# EAGLE board DSPBoard (EAGLE 9.2.2), part 1 of 2
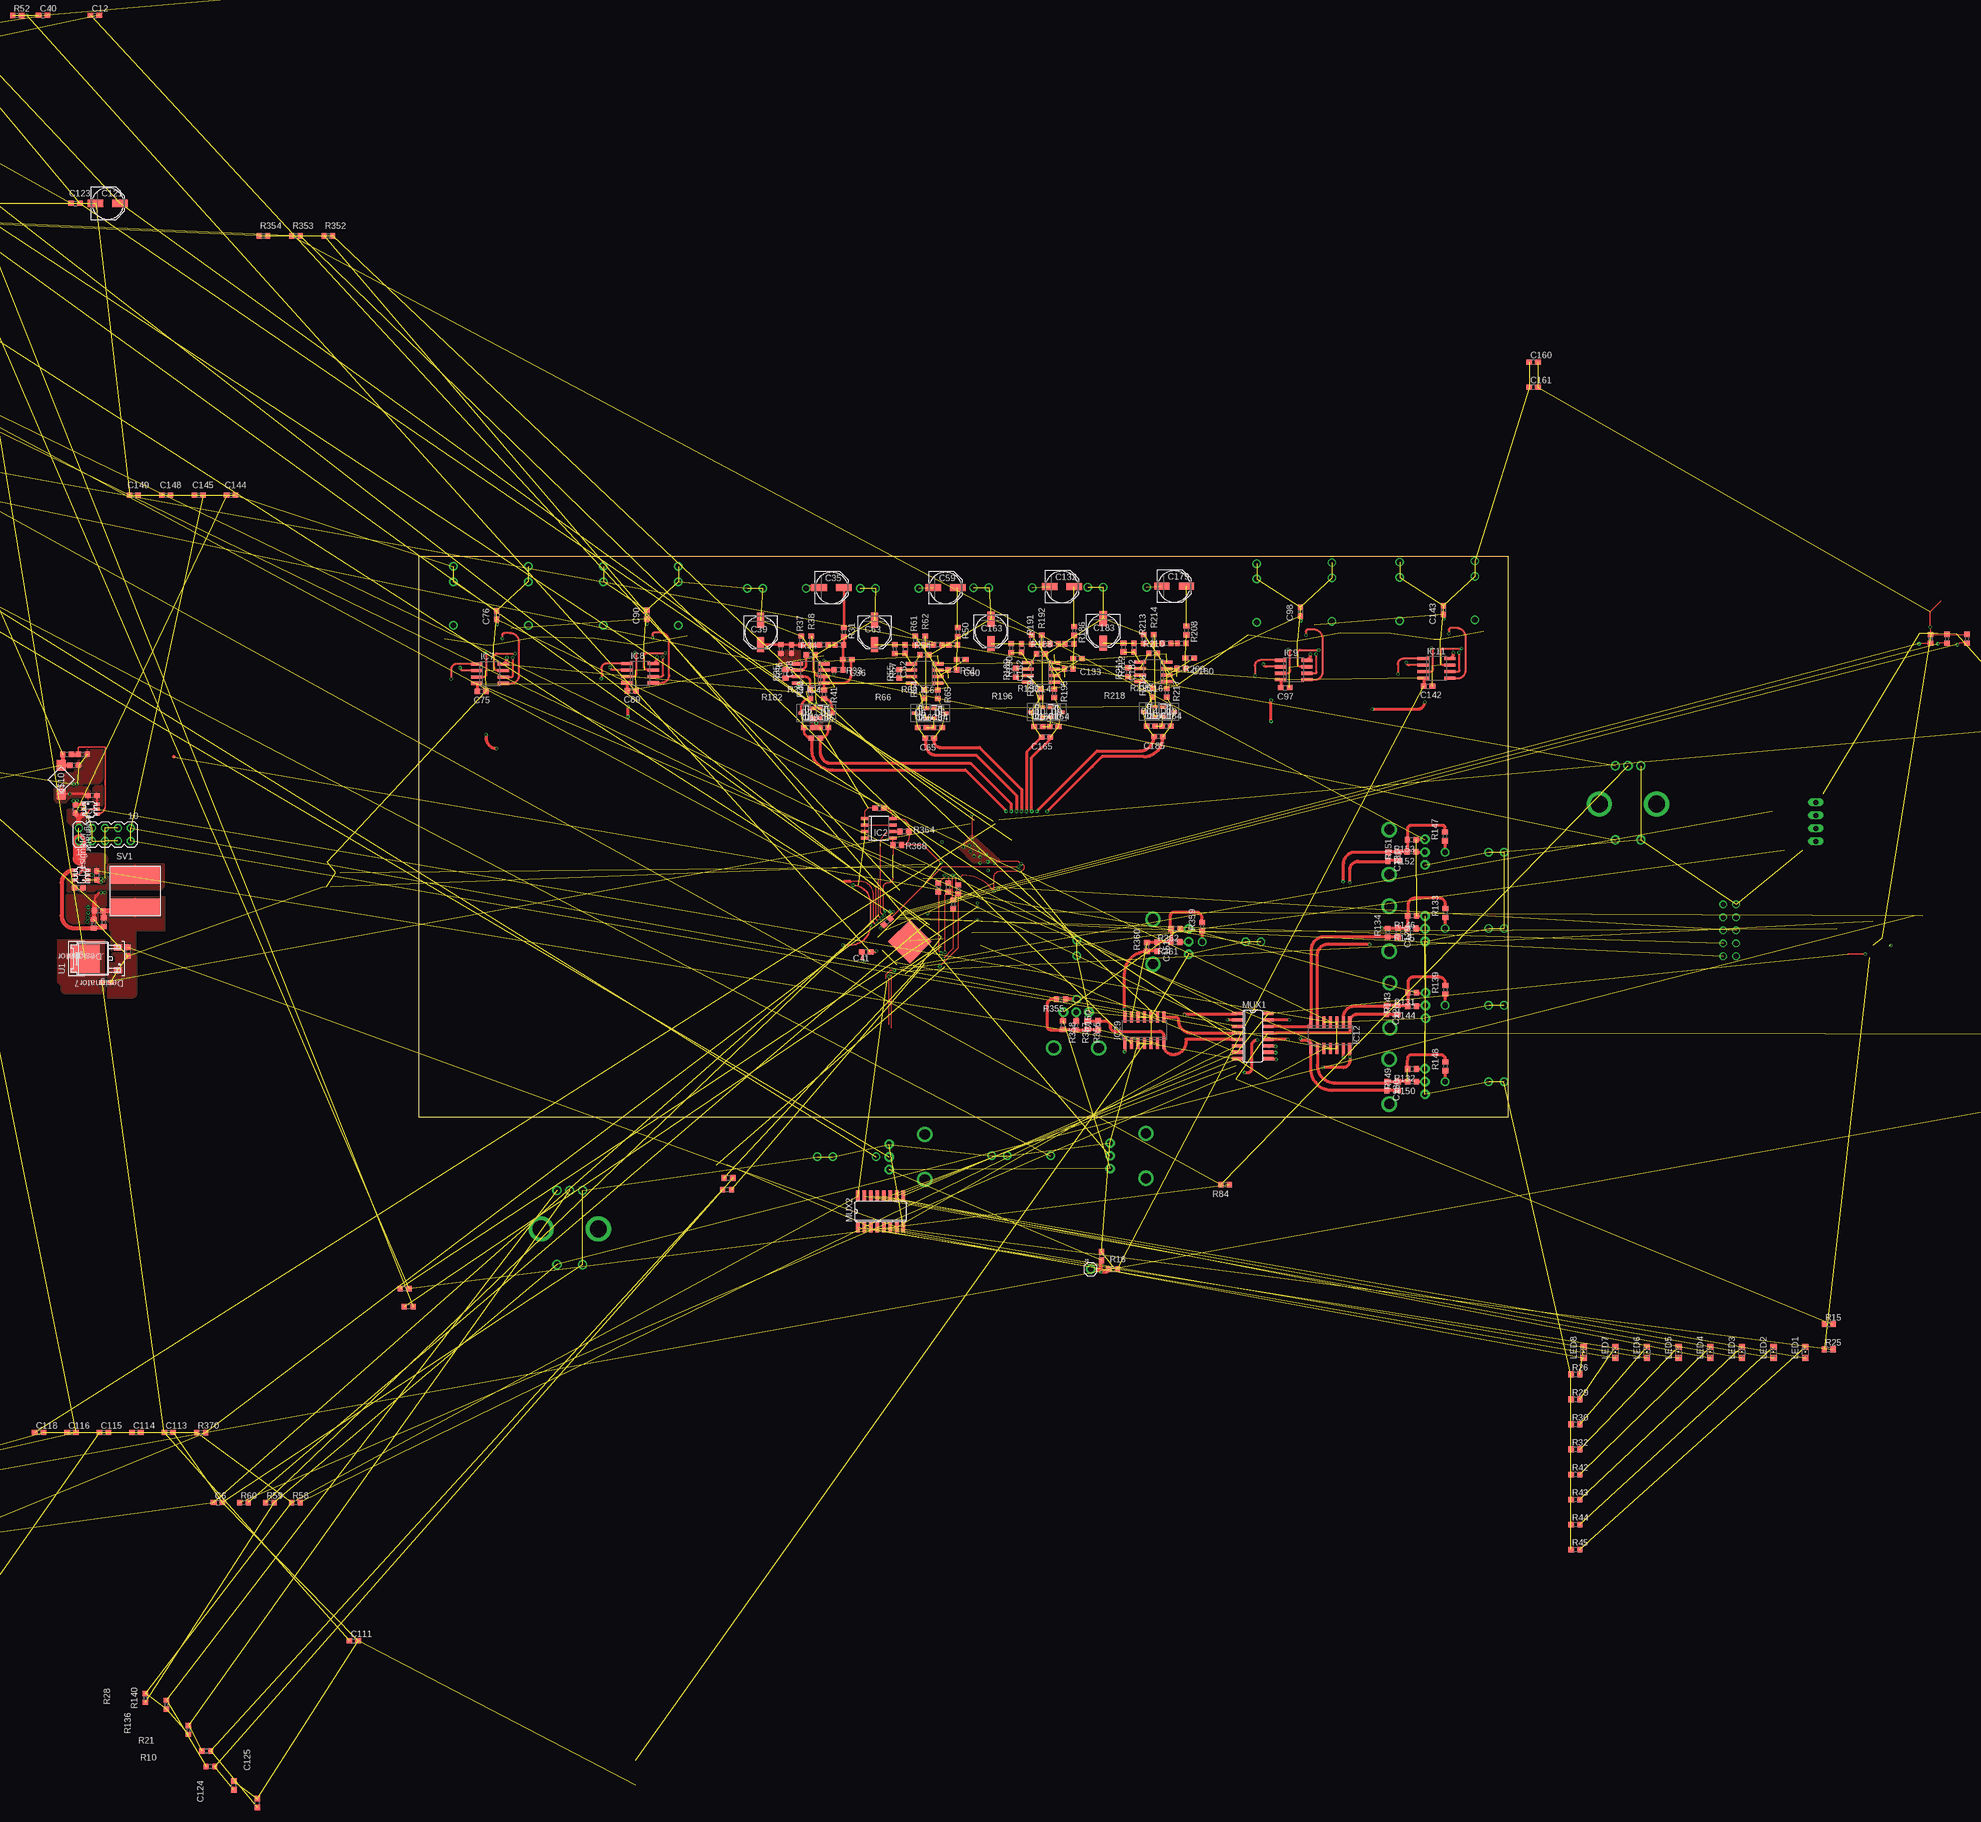
[diagram p9: board, top side]
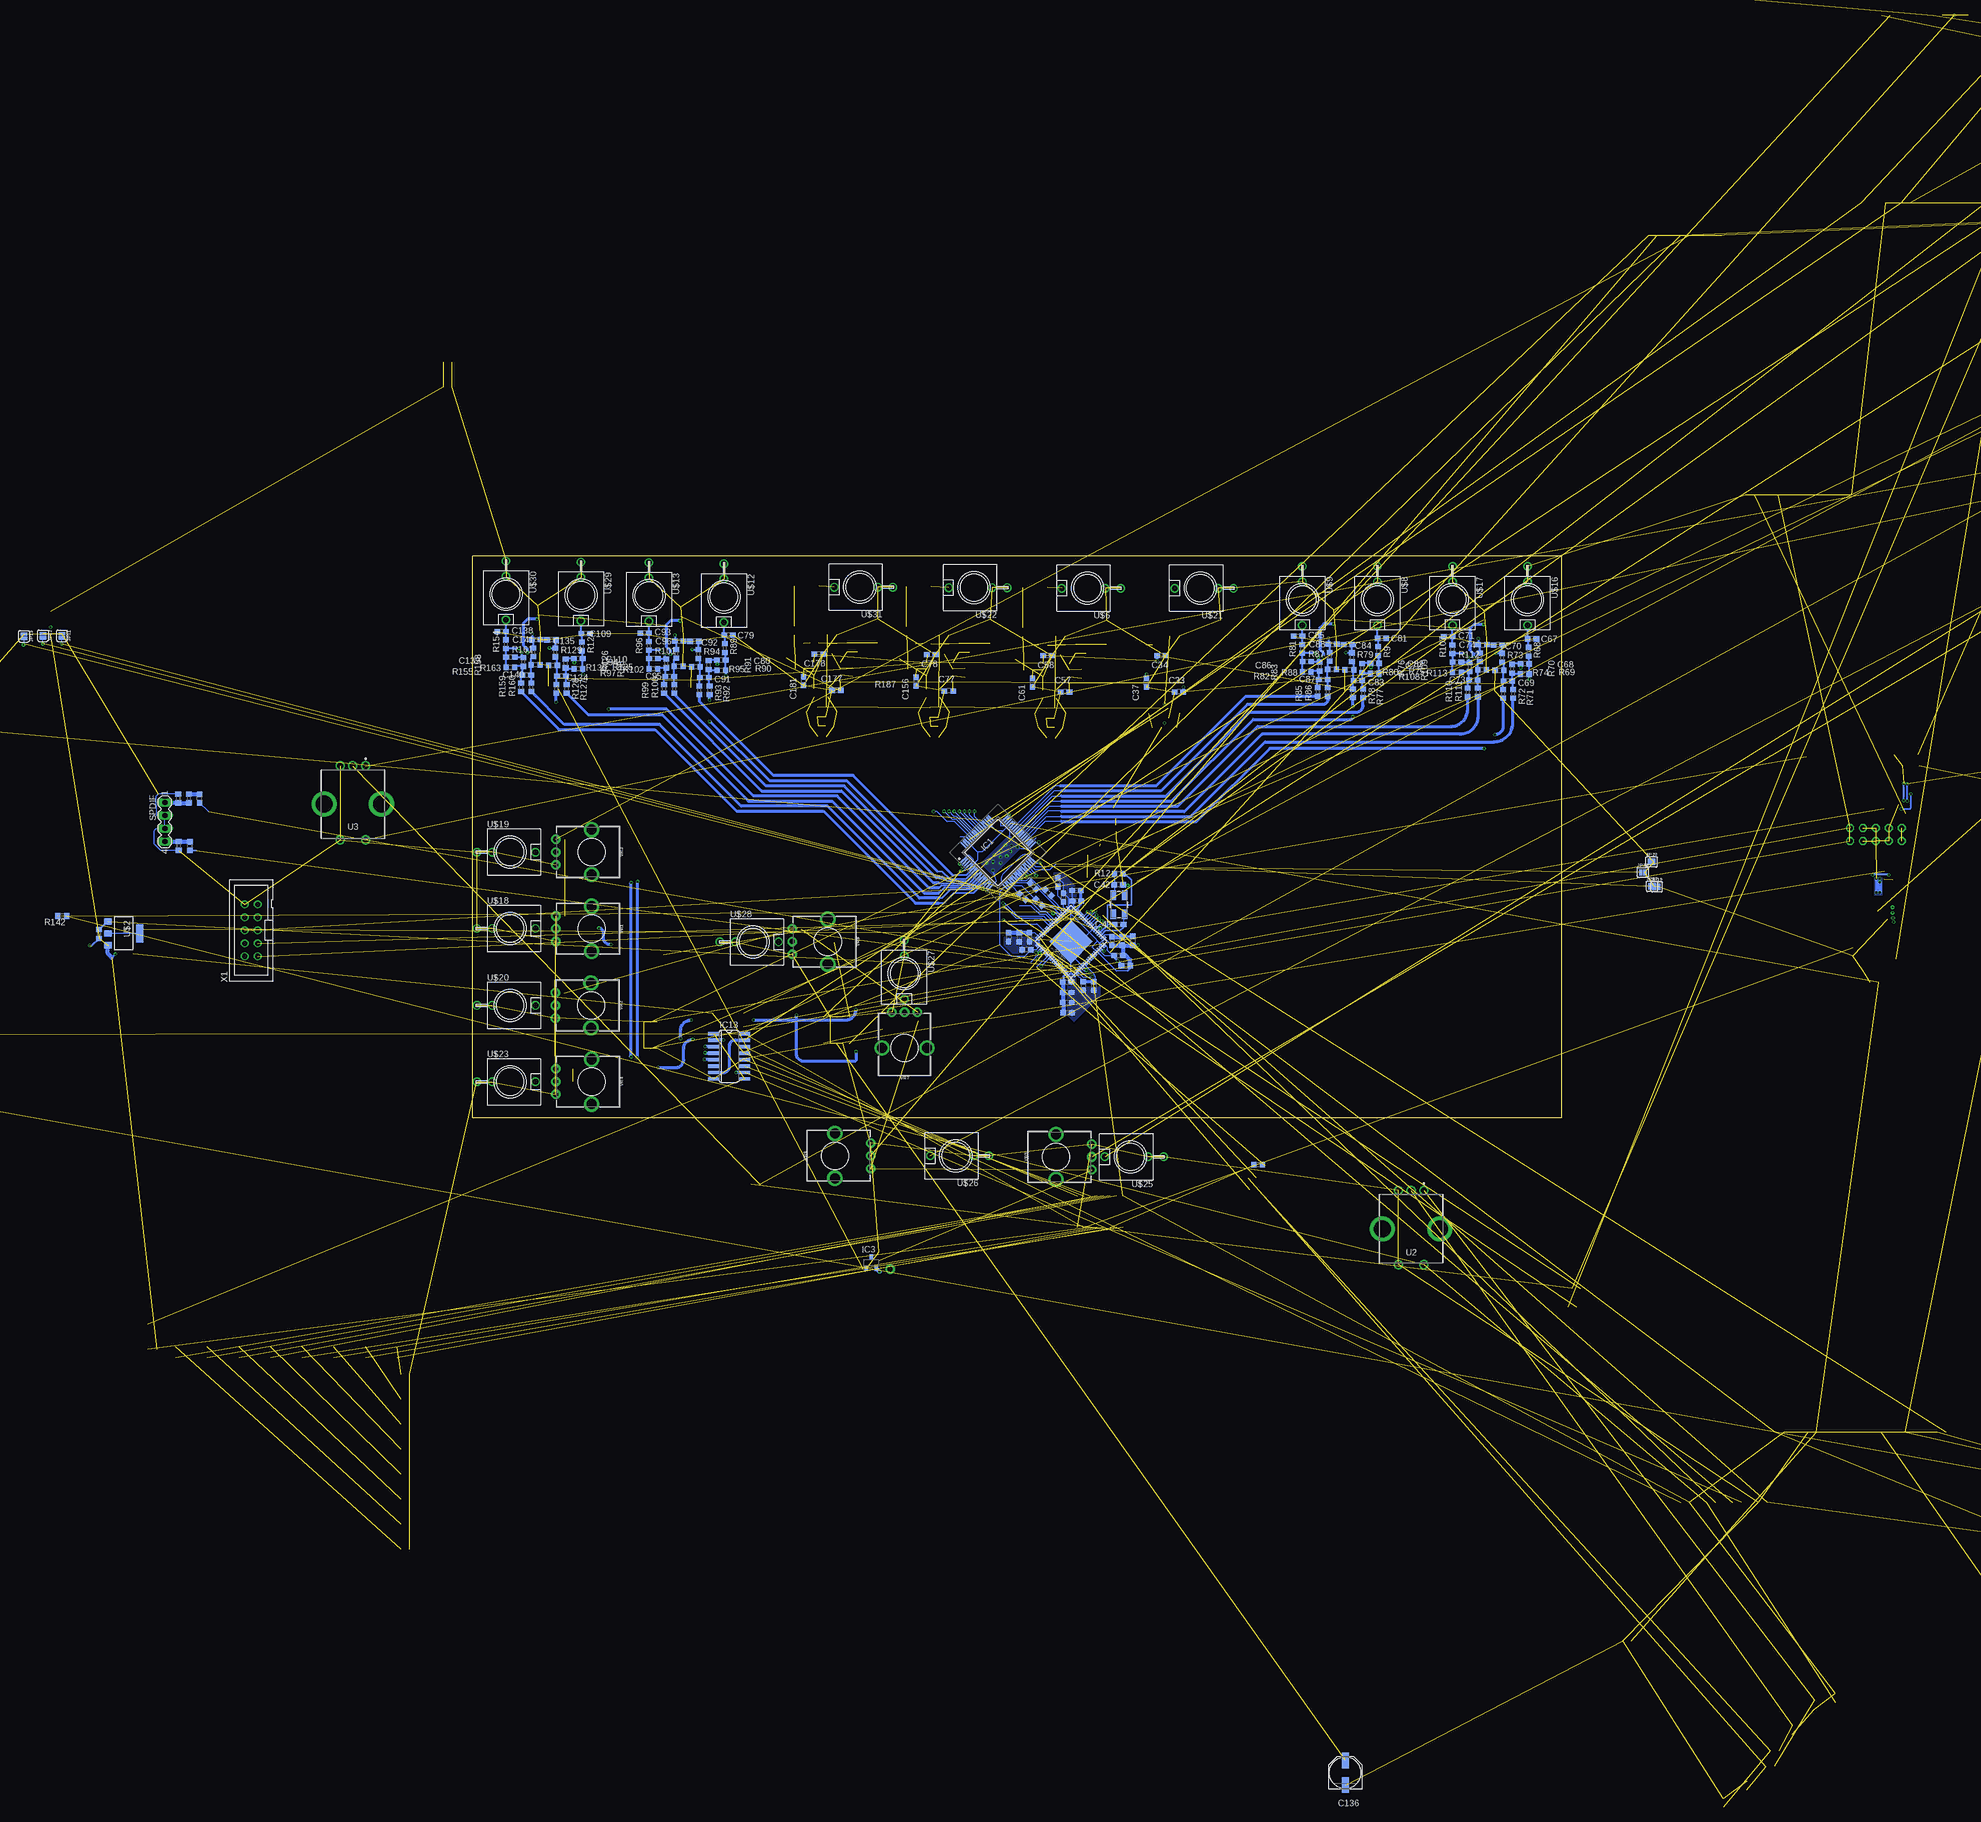
[diagram p10: board, bottom side, seen from below]

Size 213.36 x 110 mm. Coordinates in mm from the lower left corner, seen from the top.
Outline: 0,0 0,110 213.36,110 213.36,0 0,0
Copper layers (1*16): Top 0.018mm / dielectric 1.55mm / Bottom 0.018mm
Design rules "eC_2Layer_PClass6_BaseCopperO18_eCDefault": minimum track width 0.15mm, minimum drill 0.35mm, track to track 0.15mm, track to pad 0.15mm, pad to pad 0.15mm, via to via 0.15mm, smd to smd 0mil, copper to edge 0.25mm, drill to drill 0.35mm, minimum pad ring 0.175mm, minimum via ring 0.125mm, stop-mask expansion 0mil, vias tented up to drill 0.45mm, thermal gap 0.2mm

## Footprints (pad centres in the part's own frame; a part is rotated, then mirrored left to right if it is on the bottom)
C0603 = smd 1.1 x 1: 1 -0.85,0; 2 0.85,0
PANASONIC_D = smd 3 x 1.4: + 2.4,0; - -2.4,0
SOT95P230X110-3N = smd 1.05 x 0.6: 1 -1.1,0.95; 2 -1.1,-0.95; 3 1.1,0
QFP50P1200X1200X160-64N = smd 1.475 x 0.3: 1 -5.738,3.75; 2 -5.738,3.25; 3 -5.738,2.75; 4 -5.738,2.25; 5 -5.738,1.75; 6 -5.738,1.25; 7 -5.738,0.75; 8 -5.738,0.25; 9 -5.738,-0.25; 10 -5.738,-0.75; 11 -5.738,-1.25; 12 -5.738,-1.75; 13 -5.738,-2.25; 14 -5.738,-2.75; 15 -5.738,-3.25; 16 -5.738,-3.75; 33 5.738,-3.75; 34 5.738,-3.25; 35 5.738,-2.75; 36 5.738,-2.25; 37 5.738,-1.75; 38 5.738,-1.25; 39 5.738,-0.75; 40 5.738,-0.25; 41 5.738,0.25; 42 5.738,0.75; 43 5.738,1.25; 44 5.738,1.75; 45 5.738,2.25; 46 5.738,2.75; 47 5.738,3.25; 48 5.738,3.75 | smd 0.3 x 1.475: 17 -3.75,-5.738; 18 -3.25,-5.738; 19 -2.75,-5.738; 20 -2.25,-5.738; 21 -1.75,-5.738; 22 -1.25,-5.738; 23 -0.75,-5.738; 24 -0.25,-5.738; 25 0.25,-5.738; 26 0.75,-5.738; 27 1.25,-5.738; 28 1.75,-5.738; 29 2.25,-5.738; 30 2.75,-5.738; 31 3.25,-5.738; 32 3.75,-5.738; 49 3.75,5.738; 50 3.25,5.738; 51 2.75,5.738; 52 2.25,5.738; 53 1.75,5.738; 54 1.25,5.738; 55 0.75,5.738; 56 0.25,5.738; 57 -0.25,5.738; 58 -0.75,5.738; 59 -1.25,5.738; 60 -1.75,5.738; 61 -2.25,5.738; 62 -2.75,5.738; 63 -3.25,5.738; 64 -3.75,5.738
SOIC8 = smd 0.6 x 1.5: 1 -1.905,-2.75; 2 -0.635,-2.75; 3 0.635,-2.75; 4 1.905,-2.75; 5 1.905,2.75; 6 0.635,2.75; 7 -0.635,2.75; 8 -1.905,2.75
DBZ_R-PDSO-G3 = smd 0.7 x 1: 1 -0.95,-1.1; 2 0.95,-1.1; 3 0,1.1
SO08 = smd 0.6 x 2.2: 1 -1.905,-2.6; 2 -0.635,-2.6; 3 0.635,-2.6; 4 1.905,-2.6; 5 1.905,2.6; 6 0.635,2.6; 7 -0.635,2.6; 8 -1.905,2.6
SO14 = smd 0.6 x 2.2: 1 -3.81,-2.6; 2 -2.54,-2.6; 3 -1.27,-2.6; 4 0,-2.6; 5 1.27,-2.6; 6 2.54,-2.6; 7 3.81,-2.6; 8 3.81,2.6; 9 2.54,2.6; 10 1.27,2.6; 11 0,2.6; 12 -1.27,2.6; 13 -2.54,2.6; 14 -3.81,2.6
SO16 = smd 0.66 x 2.032: 1 -4.445,-3.073; 2 -3.175,-3.073; 3 -1.905,-3.073; 4 -0.635,-3.073; 5 0.635,-3.073; 6 1.905,-3.073; 7 3.175,-3.073; 8 4.445,-3.073; 9 4.445,3.073; 10 3.175,3.073; 11 1.905,3.073; 12 0.635,3.073; 13 -0.635,3.073; 14 -1.905,3.073; 15 -3.175,3.073; 16 -4.445,3.073
1X01 = drill 1.016 pad 1.88: 1 0,0
SMT-JUMPER_2_NC_PASTE_SILK = smd 0.635 x 1.27: 1 -0.406,0; 2 0.406,0
CHIPLED_0805 = smd 1.2 x 1.2: A 0,-1.05; C 0,1.05
R0603 = smd 1 x 1.1: 1 -0.85,0; 2 0.85,0
MA04-1 = drill 1.016 long: 1 -3.81,0; 2 -1.27,0; 3 1.27,0; 4 3.81,0
MA05-2 = drill 1.016 octagon: 1 -5.08,-1.27; 2 -5.08,1.27; 3 -2.54,-1.27; 4 -2.54,1.27; 5 0,-1.27; 6 0,1.27; 7 2.54,-1.27; 8 2.54,1.27; 9 5.08,-1.27; 10 5.08,1.27
NDP0003B = smd 1.7 x 1.3: 1 -4.3,2.285; 2 -4.3,-2.285 | smd 5.7 x 5.5: 3 2.14,0
PEC12R-4XXXF-SXXXX_1 = drill 1.2 pad 1.8: 1 -2.5,-7.5; 2 2.5,-7.5; 3 0,-7.5; 4 -2.5,7; 5 2.5,7 | drill 3.28 pad 4.8: 6 5.6,0; 7 -5.6,0
72-LEADLFCSP_VQ = smd 1 x 0.3: 1 0,9.25; 2 0,8.75; 3 0,8.25; 4 0,7.75; 5 0,7.25; 6 0,6.75; 7 0,6.25; 8 0,5.75; 9 0,5.25; 10 0,4.75; 11 0,4.25; 12 0,3.75; 13 0,3.25; 14 0,2.75; 15 0,2.25; 16 0,1.75; 17 0,1.25; 18 0,0.75; 37 10,0.75; 38 10,1.25; 39 10,1.75; 40 10,2.25; 41 10,2.75; 42 10,3.25; 43 10,3.75; 44 10,4.25; 45 10,4.75; 46 10,5.25; 47 10,5.75; 48 10,6.25; 49 10,6.75; 50 10,7.25; 51 10,7.75; 52 10,8.25; 53 10,8.75; 54 10,9.25 | smd 0.3 x 1: 19 0.75,0; 20 1.25,0; 21 1.75,0; 22 2.25,0; 23 2.75,0; 24 3.25,0; 25 3.75,0; 26 4.25,0; 27 4.75,0; 28 5.25,0; 29 5.75,0; 30 6.25,0; 31 6.75,0; 32 7.25,0; 33 7.75,0; 34 8.25,0; 35 8.75,0; 36 9.25,0; 55 9.25,10; 56 8.75,10; 57 8.25,10; 58 7.75,10; 59 7.25,10; 60 6.75,10; 61 6.25,10; 62 5.75,10; 63 5.25,10; 64 4.75,10; 65 4.25,10; 66 3.75,10; 67 3.25,10; 68 2.75,10; 69 2.25,10; 70 1.75,10; 71 1.25,10; 72 0.75,10 | smd 6 x 6: EP 5,5 | smd 6 x 6 bottom: EP1 5,5
PG-SOT-223 = smd 1.2 x 1.4: 1 -2.311,-3.099; 2 0,-3.099; 3 2.311,-3.099 | smd 3.5 x 1.4: 4 0,3.099
DDC0006A = smd 1 x 0.6: 1 -1.375,0.95; 2 -1.375,0; 3 -1.375,-0.95; 4 1.375,-0.95; 5 1.375,0; 6 1.375,0.95
PHOTON = drill 1.016 pad 1.88: 1 1.27,33.02; 2 1.27,30.48; 3 1.27,27.94; 4 1.27,25.4; 5 1.27,22.86; 6 1.27,20.32; 7 1.27,17.78; 8 1.27,15.24; 9 1.27,12.7; 10 1.27,10.16; 11 1.27,7.62; 12 1.27,5.08; 13 19.05,5.08; 14 19.05,7.62; 15 19.05,10.16; 16 19.05,12.7; 17 19.05,15.24; 18 19.05,17.78; 19 19.05,20.32; 20 19.05,22.86; 21 19.05,25.4; 22 19.05,27.94; 23 19.05,30.48; 24 19.05,33.02
WQP-PJ301M-12_JACK = drill 1.1: P$1 0,5; P$2 0,-3.5; P$3 0,-6.5
CDPH4D19F = smd 2.095 x 1.803: 1 -2.8,0; 2 2.8,0
SDR1006 = smd 3.607 x 10.008: 1 -3.2,0; 2 3.2,0
POT-PTH-ALPS-KIT = drill 1 pad 1.88: P$1 7,-2.5; P$2 7,0; P$3 7,2.5 | drill 2: P$4 0,-4.4; P$5 0,4.4
PAK100/2500-10 = drill 1 pad 1.422: 1 -5.08,-1.27; 2 -5.08,1.27; 3 -2.54,-1.27; 4 -2.54,1.27; 5 0,-1.27; 6 0,1.27; 7 2.54,-1.27; 8 2.54,1.27; 9 5.08,-1.27; 10 5.08,1.27
CRYSTAL-SMD-5X3.2-4PAD = smd 1.9 x 1.1: 1 -1.85,-1.15; 2 1.85,-1.15; 3 1.85,1.15; 4 -1.85,1.15

## Placement (x,y rotation side)
C1  22uf  [C0603]  98.7,46.11 90 bottom
C2  10nf  [C0603]  96.87,26.55 0 bottom
C3  100nf  [C0603]  88.1,34.57 270 bottom
C4  1uf  [C0603]  108.34,35.33 270 bottom
C5  22uf  [C0603]  96.78,20.55 0 bottom
C6  1uF  [C0603]  -39.38,-75.4 0 top  (outside the outline)
C7  1uf  [C0603]  95.03,44.45 180 bottom
C8  100nf  [C0603]  94.98,42.42 180 bottom
C9  10nf  [C0603]  86.09,34.6 270 bottom
C10  1uf  [C0603]  84.03,34.64 270 bottom
C11  100nf  [C0603]  96.88,24.53 0 bottom
C12  10nf  [C0603]  -63.5,215.9 0 top  (outside the outline)
C13  1uf  [C0603]  96.86,22.57 0 bottom
C14  100nf  [C0603]  106.25,35.32 270 bottom
C15  10nf  [C0603]  104.25,35.34 270 bottom
C16  100nf  [C0603]  85.37,29.74 0 bottom
C18  22uf  [C0603]  91.67,25.76 270 bottom
C19  100nf  [C0603]  104.84,32.86 180 bottom
C20  100nf  [C0603]  86.83,31.75 0 bottom
C21  100nf  [C0603]  93.72,25.76 270 bottom
C22  100nf  [C0603]  97.56,43.1 90 bottom
C23  100nf  [C0603]  -175.26,204.47 0 top  (outside the outline)
C24  22uf  [C0603]  -123.19,198.12 0 top  (outside the outline)
C26  22u  [C0603]  -67.32,60.43 90 top  (outside the outline)
C27  47u  [C0603]  -67.56,69 0 top  (outside the outline)
C28  100n  [C0603]  -63.97,63.1 180 top  (outside the outline)
C29  47u  [C0603]  -62.76,40.5 180 top  (outside the outline)
C30  100nf  [C0603]  -66.68,45.02 0 top  (outside the outline)
C31  22u  [C0603]  -63.18,47.45 270 top  (outside the outline)
C32  10uF  [C0603]  -57.03,32.51 270 top  (outside the outline)
C33  100nf  [C0603]  74.97,83.38 180 bottom
C34  100nf  [C0603]  78.42,90.48 180 bottom
C35  220uF  [PANASONIC_D]  80.8,103.8 0 top
C36  1nF  [C0603]  83.87,89.72 0 top
C37  470p  [C0603]  81.37,85.19 90 bottom
C38  1uF  [C0603]  72.92,91.77 270 top
C39  100uF  [PANASONIC_D]  66.89,95.04 270 top
C40  5.6n  [C0603]  -73.66,215.9 0 top  (outside the outline)
C41  150p  [C0603]  87.58,32.4 180 top
C42  22p  [C0603]  86.78,45.6 180 bottom
C43  22p  [C0603]  86.7,37.8 0 bottom
C44  100n  [C0603]  -93.5,69.2 0 top  (outside the outline)
C45  100n  [C0603]  133.7,-27.12 270 top  (outside the outline)
C46  100pF  [C0603]  79.29,76.4 0 top
C47  10nF  [C0603]  77.71,74.33 180 top
C48  100pF  [C0603]  76.24,76.4 0 top
C57  100nf  [C0603]  97.27,83.38 180 bottom
C58  100nf  [C0603]  100.72,90.48 180 bottom
C59  220uF  [PANASONIC_D]  103.1,103.8 0 top
C60  1nF  [C0603]  106.17,89.72 0 top
C61  470p  [C0603]  103.67,85.19 90 bottom
C62  1uF  [C0603]  95.22,91.77 270 top
C63  100uF  [PANASONIC_D]  89.19,95.04 270 top
C64  100pF  [C0603]  101.59,76.4 0 top
C65  10nF  [C0603]  100.01,74.33 180 top
C66  100pF  [C0603]  98.54,76.4 0 top
C67  1nf  [C0603]  5.81,93.78 180 bottom
C68  1nf  [C0603]  7.23,88.88 180 bottom
C69  10nF  [C0603]  10.54,85.48 180 bottom
C70  1nf  [C0603]  12.49,92.58 180 bottom
C71  1nf  [C0603]  22.23,94.22 0 bottom
C72  1nf  [C0603]  20.51,89.22 0 bottom
C73  10nF  [C0603]  17.31,85.7 0 bottom
C74  1nf  [C0603]  15.49,92.62 0 bottom
C75  100nF  [C0603]  12.24,83.5 0 top
C76  100nF  [C0603]  15.2,98.41 270 top
C77  100nf  [C0603]  120.07,83.58 180 bottom
C78  100nf  [C0603]  123.52,90.68 180 bottom
C79  1nf  [C0603]  163.21,94.48 180 bottom
C80  1nf  [C0603]  164.63,89.58 180 bottom
C81  1nf  [C0603]  35.21,93.88 180 bottom
C82  1nf  [C0603]  36.63,88.98 180 bottom
C83  10nF  [C0603]  39.94,85.58 180 bottom
C84  1nf  [C0603]  41.89,92.68 180 bottom
C85  1nf  [C0603]  51.63,94.32 0 bottom
C86  1nf  [C0603]  49.91,89.32 0 bottom
C87  10nF  [C0603]  46.71,85.8 0 bottom
C88  1nf  [C0603]  44.89,92.72 0 bottom
C89  100nF  [C0603]  41.64,83.6 0 top
C90  100nF  [C0603]  44.6,98.51 270 top
C91  10nF  [C0603]  167.94,86.18 180 bottom
C92  1nf  [C0603]  169.89,93.28 180 bottom
C93  1nf  [C0603]  179.63,94.92 0 bottom
C94  1nf  [C0603]  177.91,89.92 0 bottom
C95  10nF  [C0603]  174.71,86.4 0 bottom
C96  1nf  [C0603]  172.89,93.32 0 bottom
C97  100nF  [C0603]  169.64,84.2 0 top
C98  100nF  [C0603]  172.6,99.11 270 top
C109  1nf  [C0603]  191.21,94.78 180 bottom
C110  1nf  [C0603]  192.63,89.88 180 bottom
C111  0.1u  [C0603]  -12.78,-102.5 0 top  (outside the outline)
C112  0.1u  [C0603]  -200.66,179.07 0 top  (outside the outline)
C113  0.1u  [C0603]  -49.03,-61.68 0 top  (outside the outline)
C114  0.1u  [C0603]  -55.38,-61.68 0 top  (outside the outline)
C115  10uf  [C0603]  -61.73,-61.68 0 top  (outside the outline)
C116  10u  [C0603]  -68.08,-61.68 0 top  (outside the outline)
C117  0.1u  [C0603]  -207.01,179.07 0 top  (outside the outline)
C118  0.1u  [C0603]  -74.43,-61.68 0 top  (outside the outline)
C119  47uF  [PANASONIC_D]  313.33,78.56 270 bottom  (outside the outline)
C120  0.1u  [C0603]  -87.63,210.82 0 top  (outside the outline)
C121  47uF  [PANASONIC_D]  -60.96,179.07 0 top  (outside the outline)
C122  390pF  [C0603]  -93.98,210.82 0 top  (outside the outline)
C123  5.6nF  [C0603]  -67.31,179.07 0 top  (outside the outline)
C124  10nF  [C0603]  -31.67,-134.26 90 top  (outside the outline)
C125  10nF  [C0603]  -36.27,-130.81 90 top  (outside the outline)
C126  10nF  [C0603]  -86.36,179.07 0 top  (outside the outline)
C127  10nF  [C0603]  -92.71,179.07 0 top  (outside the outline)
C128  1n  [C0603]  189.47,21.06 270 top
C129  1n  [C0603]  191.77,36.21 270 top
C130  1n  [C0603]  189.57,6.16 270 top
C131  1n  [C0603]  189.77,51.11 270 top
C132  220uF  [PANASONIC_D]  125.9,104 0 top
C133  1nF  [C0603]  128.97,89.92 0 top
C134  10nF  [C0603]  195.94,86.48 180 bottom
C135  1nf  [C0603]  197.89,93.58 180 bottom
C136  100uF  [PANASONIC_D]  42.39,-128.34 90 bottom  (outside the outline)
C137  100uF  [C0603]  -61.26,26.47 0 top  (outside the outline)
C138  1nf  [C0603]  207.63,95.22 0 bottom
C139  1nf  [C0603]  205.91,90.22 0 bottom
C140  10nF  [C0603]  202.71,86.7 0 bottom
C141  1nf  [C0603]  200.89,93.62 0 bottom
C142  100nF  [C0603]  197.64,84.5 0 top
C143  100nF  [C0603]  200.6,99.41 270 top
C144  100nF  [C0603]  -36.83,121.92 0 top  (outside the outline)
C145  100nF  [C0603]  -43.18,121.92 0 top  (outside the outline)
C146  1n  [C0603]  -168.91,179.07 0 top  (outside the outline)
C147  1n  [C0603]  -175.26,179.07 0 top  (outside the outline)
C148  100nF  [C0603]  -49.53,121.92 0 top  (outside the outline)
C149  100nF  [C0603]  -55.88,121.92 0 top  (outside the outline)
C150  1n  [C0603]  133.03,18.09 90 top
C151  1n  [C0603]  144.57,33.46 270 top
C152  100n  [C0603]  -100.33,210.82 0 top  (outside the outline)
C153  100n  [C0603]  -106.68,210.82 0 top  (outside the outline)
C154  100n  [C0603]  -113.03,210.82 0 top  (outside the outline)
C155  100n  [C0603]  -93.5,64.3 0 top  (outside the outline)
C156  470p  [C0603]  126.47,85.39 90 bottom
C157  100nF  [C0603]  268.7,53.2 90 bottom  (outside the outline)
C158  100nF  [C0603]  266.8,62.5 90 bottom  (outside the outline)
C159  0.1u  [C0603]  90.2,60.6 0 top
C160  10uF  [C0603]  218.3,148 0 top  (outside the outline)
C161  0.1uF  [C0603]  218.3,143.1 0 top  (outside the outline)
C162  1uF  [C0603]  118.02,91.97 270 top
C163  100uF  [PANASONIC_D]  111.99,95.24 270 top
C164  100pF  [C0603]  124.39,76.6 0 top
C165  10nF  [C0603]  122.81,74.53 180 top
C166  100pF  [C0603]  121.34,76.6 0 top
C177  100nf  [C0603]  142.07,83.68 180 bottom
C178  100nf  [C0603]  145.52,90.78 180 bottom
C179  220uF  [PANASONIC_D]  147.9,104.1 0 top
C180  1nF  [C0603]  150.97,90.02 0 top
C181  470p  [C0603]  148.47,85.49 90 bottom
C182  1uF  [C0603]  140.02,92.07 270 top
C183  100uF  [PANASONIC_D]  133.99,95.34 270 top
C184  100pF  [C0603]  146.39,76.7 0 top
C185  10nF  [C0603]  144.81,74.63 180 top
C186  100pF  [C0603]  143.34,76.7 0 top
D1  BAV99,215  [SOT95P230X110-3N]  79.74,79.18 0 top
D2  BAV99,215  [SOT95P230X110-3N]  75.92,79.22 180 top
D5  BAV99,215  [SOT95P230X110-3N]  102.04,79.18 0 top
D6  BAV99,215  [SOT95P230X110-3N]  98.22,79.22 180 top
D9  BAV99,215  [SOT95P230X110-3N]  124.84,79.38 0 top
D10  BAV99,215  [SOT95P230X110-3N]  121.02,79.42 180 top
D13  BAV99,215  [SOT95P230X110-3N]  146.84,79.48 0 top
D14  BAV99,215  [SOT95P230X110-3N]  143.02,79.52 180 top
IC1  AD1939WBSTZ  [QFP50P1200X1200X160-64N]  110.42,51.94 45 bottom
IC2  24AA1025  [SOIC8]  90.03,56.63 270 top
IC3  LM4040B10DBZ  [DBZ_R-PDSO-G3]  135.25,-28.44 0 bottom  (outside the outline)
IC4  LM833D  [SO08]  76.74,86.98 90 top
IC6  LM833D  [SO08]  99.04,86.98 90 top
IC7  LM833D  [SO08]  13.89,86.96 270 top
IC8  LM833D  [SO08]  43.29,87.06 270 top
IC9  LM833D  [SO08]  171.29,87.66 270 top
IC11  LM833D  [SO08]  199.29,87.96 270 top
IC12  TL074D  [SO14]  178.47,16.11 180 top
IC13  4520D  [SO16]  163.1,12 270 bottom
IC14  LM833D  [SO08]  121.84,87.18 90 top
IC16  LM833D  [SO08]  143.84,87.28 90 top
IC29  TL074D  [SO14]  142.06,17.09 0 top
J1  [1X01]  131.54,-29.7 0 top  (outside the outline)
J2  [1X01]  -84.37,-92.7 0 top  (outside the outline)
J3  [1X01]  -88.18,-92.7 0 top  (outside the outline)
J4  [1X01]  -15.24,220.98 0 top  (outside the outline)
JP1  JUMPER-SMT_2_NC_PASTE_SILK  [SMT-JUMPER_2_NC_PASTE_SILK]  -217.9,-133.8 0 top  (outside the outline)
JP2  JUMPER-SMT_2_NC_PASTE_SILK  [SMT-JUMPER_2_NC_PASTE_SILK]  390.5,16.3 0 top  (outside the outline)
JP3  JUMPER-SMT_2_NC_PASTE_SILK  [SMT-JUMPER_2_NC_PASTE_SILK]  -226.5,-133.8 0 top  (outside the outline)
JP11  JUMPER-SMT_2_NC_PASTE_SILK  [SMT-JUMPER_2_NC_PASTE_SILK]  293.8,94.4 270 bottom  (outside the outline)
JP12  JUMPER-SMT_2_NC_PASTE_SILK  [SMT-JUMPER_2_NC_PASTE_SILK]  297.5,94.4 270 bottom  (outside the outline)
JP13  JUMPER-SMT_2_NC_PASTE_SILK  [SMT-JUMPER_2_NC_PASTE_SILK]  301.2,94.3 270 bottom  (outside the outline)
JP17  JUMPER-SMT_2_NC_PASTE_SILK  [SMT-JUMPER_2_NC_PASTE_SILK]  -17.7,45.3 0 bottom  (outside the outline)
JP18  JUMPER-SMT_2_NC_PASTE_SILK  [SMT-JUMPER_2_NC_PASTE_SILK]  -15.9,48 0 bottom  (outside the outline)
JP19  JUMPER-SMT_2_NC_PASTE_SILK  [SMT-JUMPER_2_NC_PASTE_SILK]  -18.6,45.2 0 bottom  (outside the outline)
JP20  JUMPER-SMT_2_NC_PASTE_SILK  [SMT-JUMPER_2_NC_PASTE_SILK]  -17.6,50.1 0 bottom  (outside the outline)
LED1  [CHIPLED_0805]  271.5,-46 0 top  (outside the outline)
LED2  [CHIPLED_0805]  265.3,-46 0 top  (outside the outline)
LED3  [CHIPLED_0805]  259.1,-46 0 top  (outside the outline)
LED4  [CHIPLED_0805]  252.9,-46 0 top  (outside the outline)
LED5  [CHIPLED_0805]  246.7,-46 0 top  (outside the outline)
LED6  [CHIPLED_0805]  240.5,-46 0 top  (outside the outline)
LED7  [CHIPLED_0805]  234.3,-46 0 top  (outside the outline)
LED8  [CHIPLED_0805]  228.1,-46 0 top  (outside the outline)
MUX1  4051D  [SO16]  163.29,15.94 270 top
MUX2  4051D  [SO16]  90.4,-18.4 0 top  (outside the outline)
R1  1k  [R0603]  286.5,35.95 270 bottom  (outside the outline)
R2  33.2k  [R0603]  -68.93,71.12 0 top  (outside the outline)
R3  10k  [R0603]  -65.87,71.12 0 top  (outside the outline)
R4  61.9k  [R0603]  -61.78,38.28 270 top  (outside the outline)
R5  10k  [R0603]  -63.72,37.95 90 top  (outside the outline)
R6  33R  [R0603]  105.6,44.71 270 top
R7  33R  [R0603]  103.62,45.08 270 top
R8  33R  [R0603]  101.73,45.08 270 top
R9  100R  [R0603]  35.92,91.37 90 bottom
R10  10k  [R0603]  -40.86,-127.13 0 top  (outside the outline)
R11  33r  [R0603]  104.6,41.8 270 top
R12  100R  [R0603]  86.78,47.72 0 bottom
R13  10k  [R0603]  299.3,93.8 270 top  (outside the outline)
R14  100k  [R0603]  -151.13,172.72 0 top  (outside the outline)
R15  33R  [R0603]  276.1,-40.5 0 top  (outside the outline)
R16  470  [R0603]  135.94,-29.73 0 top  (outside the outline)
R17  10k  [R0603]  -129.54,215.9 0 top  (outside the outline)
R18  33R  [R0603]  100.58,44.04 315 bottom
R19  33R  [R0603]  103.54,45.34 315 bottom
R20  33R  [R0603]  102.46,42.14 315 bottom
R21  10k  [R0603]  -41.69,-124.07 180 top  (outside the outline)
R22  10k  [R0603]  -99.06,191.77 0 top  (outside the outline)
R23  33R  [R0603]  105.6,43.24 315 bottom
R24  33R  [R0603]  -2.85,-33.49 0 top  (outside the outline)
R25  10k  [R0603]  276.1,-45.4 0 top  (outside the outline)
R26  470  [R0603]  226.5,-50.3 0 top  (outside the outline)
R27  33R  [R0603]  59.47,-9.25 180 bottom  (outside the outline)
R28  10k  [R0603]  -49.47,-115.01 90 top  (outside the outline)
R29  470  [R0603]  226.5,-55.2 0 top  (outside the outline)
R30  470  [R0603]  226.5,-60.1 0 top  (outside the outline)
R31  18k  [R0603]  83.2,95.1 270 top
R32  470  [R0603]  226.5,-65 0 top  (outside the outline)
R33  2.7k  [R0603]  82.16,87.68 180 top
R34  2.2k  [R0603]  76.69,90.62 0 top
R35  2.2k  [R0603]  71.78,86.94 90 top
R36  12.7k  [R0603]  70.88,91.77 90 top
R37  10k  [R0603]  74.87,93.43 270 top
R38  10k  [R0603]  76.83,93.43 90 top
R39  6k2  [R0603]  82.29,92.57 0 top
R40  22R  [R0603]  76.63,82.94 90 top
R41  22R  [R0603]  79.33,82.89 90 top
R42  470  [R0603]  226.5,-69.9 0 top  (outside the outline)
R43  470  [R0603]  226.5,-74.8 0 top  (outside the outline)
R44  470  [R0603]  226.5,-79.7 0 top  (outside the outline)
R45  470  [R0603]  226.5,-84.6 0 top  (outside the outline)
R50  18k  [R0603]  105.5,95.1 270 top
R51  2.7k  [R0603]  104.46,87.68 180 top
R52  4.3k  [R0603]  -78.74,215.9 0 top  (outside the outline)
R54  2.2k  [R0603]  98.99,90.62 0 top
R55  2.2k  [R0603]  94.08,86.94 90 top
R56  33R  [R0603]  -2.05,-37.07 0 top  (outside the outline)
R57  12.7k  [R0603]  93.18,91.77 90 top
R58  10k  [R0603]  -24.14,-75.4 0 top  (outside the outline)
R59  33R  [R0603]  -29.22,-75.4 0 top  (outside the outline)
R60  33R  [R0603]  -34.3,-75.4 0 top  (outside the outline)
R61  10k  [R0603]  97.17,93.43 270 top
R62  10k  [R0603]  99.13,93.43 90 top
R63  6k2  [R0603]  104.59,92.57 0 top
R64  22R  [R0603]  98.93,82.94 90 top
R65  22R  [R0603]  101.63,82.89 90 top
R66  100  [R0603]  101.6,92.6 0 top
R68  100R  [R0603]  6.52,91.27 90 bottom
R69  2.2k  [R0603]  7.23,86.87 0 bottom
R70  68R  [R0603]  9.72,87.94 90 bottom
R71  2.2k  [R0603]  9.52,83 90 bottom
R72  2.2k  [R0603]  11.5,83 90 bottom
R73  68R  [R0603]  11.7,90.09 90 bottom
R74  2.2k  [R0603]  12.19,87.57 0 bottom
R75  2.2k  [R0603]  36.63,86.97 0 bottom
R76  68R  [R0603]  39.12,88.04 90 bottom
R77  2.2k  [R0603]  38.92,83.1 90 bottom
R78  2.2k  [R0603]  40.9,83.1 90 bottom
R79  68R  [R0603]  41.1,90.19 90 bottom
R80  2.2k  [R0603]  41.59,87.67 0 bottom
R81  100R  [R0603]  50.82,91.82 90 bottom
R82  2.2k  [R0603]  49.94,87.28 180 bottom
R83  68R  [R0603]  47.42,88.34 90 bottom
R84  10k  [R0603]  157.91,-13.12 180 top  (outside the outline)
R85  2.2k  [R0603]  47.82,83.36 90 bottom
R86  2.2k  [R0603]  45.82,83.36 90 bottom
R87  68R  [R0603]  45.42,90.24 90 bottom
R88  2.2k  [R0603]  44.99,87.8 180 bottom
R89  100R  [R0603]  163.92,91.97 90 bottom
R90  2.2k  [R0603]  164.63,87.57 0 bottom
R91  68R  [R0603]  167.12,88.64 90 bottom
R92  2.2k  [R0603]  166.92,83.7 90 bottom
R93  2.2k  [R0603]  168.9,83.7 90 bottom
R94  68R  [R0603]  169.1,90.79 90 bottom
R95  2.2k  [R0603]  169.59,88.27 0 bottom
R96  100R  [R0603]  178.82,92.42 90 bottom
R97  2.2k  [R0603]  177.94,87.88 180 bottom
R98  68R  [R0603]  175.42,88.94 90 bottom
R99  2.2k  [R0603]  175.82,83.97 90 bottom
R100  2.2k  [R0603]  173.82,83.97 90 bottom
R101  68R  [R0603]  173.42,90.84 90 bottom
R102  2.2k  [R0603]  172.99,88.4 180 bottom
R107  100R  [R0603]  21.42,91.72 90 bottom
R108  2.2k  [R0603]  20.54,87.18 180 bottom
R109  68R  [R0603]  18.02,88.24 90 bottom
R110  2.2k  [R0603]  18.42,83.27 90 bottom
R111  2.2k  [R0603]  16.42,83.27 90 bottom
R112  68R  [R0603]  16.02,90.14 90 bottom
R113  2.2k  [R0603]  15.59,87.7 180 bottom
R124  100R  [R0603]  191.92,92.27 90 bottom
R125  2.2k  [R0603]  192.63,87.87 0 bottom
R126  68R  [R0603]  195.12,88.94 90 bottom
R127  2.2k  [R0603]  194.92,84 90 bottom
R128  2.2k  [R0603]  196.9,84 90 bottom
R129  68R  [R0603]  197.1,91.09 90 bottom
R130  2.2k  [R0603]  197.59,88.57 0 bottom
R131  200k  [R0603]  194.53,24.43 180 top
R132  200k  [R0603]  194.48,9.53 180 top
R133  100k  [R0603]  201.03,40.07 90 top
R134  15k  [R0603]  189.73,36.22 90 top
R135  562R  [R0603]  -125.73,210.82 0 top  (outside the outline)
R136  10k  [R0603]  -45.17,-119.93 90 top  (outside the outline)
R137  10k  [R0603]  -93.98,128.27 0 top  (outside the outline)
R138  10k  [R0603]  -100.33,128.27 0 top  (outside the outline)
R139  100k  [R0603]  201.03,25.02 90 top
R140  10k  [R0603]  -53.63,-113.67 270 top  (outside the outline)
R141  10k  [R0603]  -119.38,128.27 0 top  (outside the outline)
R142  33R  [R0603]  293.72,39.48 180 bottom  (outside the outline)
R143  15k  [R0603]  191.63,21.07 90 top
R144  100k  [R0603]  194.48,21.83 180 top
R145  100k  [R0603]  194.43,37.03 180 top
R146  200k  [R0603]  194.48,39.53 180 top
R147  100k  [R0603]  200.93,55.07 90 top
R148  100k  [R0603]  201.03,10.02 90 top
R149  15k  [R0603]  191.73,6.17 90 top
R150  100k  [R0603]  194.48,7.03 180 top
R151  15k  [R0603]  191.83,51.17 90 top
R152  100k  [R0603]  194.38,52.03 180 top
R153  200k  [R0603]  194.43,54.43 180 top
R154  100R  [R0603]  206.82,92.72 90 bottom
R155  2.2k  [R0603]  205.94,88.18 180 bottom
R156  33R  [R0603]  60.32,-14.11 180 top  (outside the outline)
R157  33R  [R0603]  60.61,-11.83 0 top  (outside the outline)
R158  68R  [R0603]  203.42,89.24 90 bottom
R159  2.2k  [R0603]  203.82,84.27 90 bottom
R160  2.2k  [R0603]  201.82,84.27 90 bottom
R161  68R  [R0603]  201.42,91.14 90 bottom
R162  33R  [R0603]  -138.43,210.82 0 top  (outside the outline)
R163  2.2k  [R0603]  200.99,88.7 180 bottom
R177  240R  [R0603]  268.9,62.5 90 bottom  (outside the outline)
R178  100R  [R0603]  271,62.5 270 bottom  (outside the outline)
R179  75R  [R0603]  270.9,53.2 270 bottom  (outside the outline)
R180  33R  [R0603]  91.67,38.34 45 top
R181  10k  [R0603]  303.2,93.8 270 top  (outside the outline)
R182  100  [R0603]  79.3,92.6 0 top
R186  18k  [R0603]  128.3,95.3 270 top
R187  2.7k  [R0603]  127.26,87.88 180 top
R188  2.2k  [R0603]  121.79,90.82 0 top
R189  2.2k  [R0603]  116.88,87.14 90 top
R190  12.7k  [R0603]  115.98,91.97 90 top
R191  10k  [R0603]  119.97,93.63 270 top
R192  10k  [R0603]  121.93,93.63 90 top
R193  6k2  [R0603]  127.39,92.77 0 top
R194  22R  [R0603]  121.73,83.14 90 top
R195  22R  [R0603]  124.43,83.09 90 top
R196  100  [R0603]  124.4,92.8 0 top
R208  18k  [R0603]  150.3,95.4 270 top
R209  2.7k  [R0603]  149.26,87.98 180 top
R210  2.2k  [R0603]  143.79,90.92 0 top
R211  2.2k  [R0603]  138.88,87.24 90 top
R212  12.7k  [R0603]  137.98,92.07 90 top
R213  10k  [R0603]  141.97,93.73 270 top
R214  10k  [R0603]  143.93,93.73 90 top
R215  6k2  [R0603]  149.39,92.87 0 top
R216  22R  [R0603]  143.73,83.24 90 top
R217  22R  [R0603]  146.43,83.19 90 top
R218  100  [R0603]  146.4,92.9 0 top
R347  100k  [R0603]  -189.23,166.37 0 top  (outside the outline)
R348  15k  [R0603]  -195.58,166.37 0 top  (outside the outline)
R349  100k  [R0603]  -201.93,166.37 0 top  (outside the outline)
R350  100k  [R0603]  -208.28,166.37 0 top  (outside the outline)
R351  15k  [R0603]  -214.63,166.37 0 top  (outside the outline)
R352  100k  [R0603]  -17.78,172.72 0 top  (outside the outline)
R353  200k  [R0603]  -24.13,172.72 0 top  (outside the outline)
R354  200k  [R0603]  -30.48,172.72 0 top  (outside the outline)
R355  100k  [R0603]  125.73,23.18 180 top
R356  15k  [R0603]  130.92,18.08 270 top
R357  100k  [R0603]  128.72,18.03 270 top
R358  200k  [R0603]  126.12,18.08 270 top
R359  100k  [R0603]  153.38,37.37 90 top
R360  15k  [R0603]  142.58,33.42 90 top
R361  100k  [R0603]  148.13,34.38 180 top
R362  200k  [R0603]  148.18,36.98 180 top
R364  2k2  [R0603]  95.07,56.02 0 top
R367  10k  [R0603]  296.08,93.77 90 top  (outside the outline)
R368  2k2  [R0603]  93.68,53.38 180 top
R369  2k2  [R0603]  -175.73,211.42 0 top  (outside the outline)
R370  2k2  [R0603]  -42.68,-61.68 0 top  (outside the outline)
SPDIF  [MA04-1]  273.6,57.9 270 bottom  (outside the outline)
SV1  [MA05-2]  -61.54,55.46 0 top  (outside the outline)
U1  LM11173.3NOPB  [NDP0003B]  -63.31,31.11 180 top  (outside the outline)
U2  PEC11R-4315F-N0012  [PEC12R-4XXXF-SXXXX_1]  29.5,-21.8 180 bottom  (outside the outline)
U3  PEC11R-4315F-N0012  [PEC12R-4XXXF-SXXXX_1]  236.8,61.4 180 bottom  (outside the outline)
U$1  ADAU1452WBCPZ  [72-LEADLFCSP_VQ]  89.06,34.45 135 bottom
U$2  PBSS4032PZ  [PG-SOT-223]  281.65,36.06 270 bottom  (outside the outline)
U$3  TPS561201  [DDC0006A]  -66.19,47.49 180 top  (outside the outline)
U$4  TPS561201  [DDC0006A]  -64.44,60.41 0 top  (outside the outline)
U$5  PHOTON_WITH_HEADERS  [PHOTON]  -253.8,-132.7 0 top  (outside the outline)
U$6  WQP-PJ301M-12_JACK  [WQP-PJ301M-12_JACK]  92.9,103.7 90 bottom
U$8  WQP-PJ301M-12_JACK  [WQP-PJ301M-12_JACK]  36.1,101.45 180 bottom
U$9  WQP-PJ301M-12_JACK  [WQP-PJ301M-12_JACK]  50.8,101.45 180 bottom
U$10  CDPH4D19FNP-4R7MC  [CDPH4D19F]  -70.07,66.18 90 top  (outside the outline)
U$11  SDR1006-3R3M-4.7uH  [SDR1006]  -55.57,44.34 270 top  (outside the outline)
U$12  WQP-PJ301M-12_JACK  [WQP-PJ301M-12_JACK]  164.1,102 180 bottom
U$13  WQP-PJ301M-12_JACK  [WQP-PJ301M-12_JACK]  178.8,102.2 180 bottom
U$16  WQP-PJ301M-12_JACK  [WQP-PJ301M-12_JACK]  6.7,101.45 180 bottom
U$17  WQP-PJ301M-12_JACK  [WQP-PJ301M-12_JACK]  21.4,101.45 180 bottom
U$18  WQP-PJ301M-12_JACK  [WQP-PJ301M-12_JACK]  206,37.03 270 bottom
U$19  WQP-PJ301M-12_JACK  [WQP-PJ301M-12_JACK]  206,52 270 bottom
U$20  WQP-PJ301M-12_JACK  [WQP-PJ301M-12_JACK]  206,21.97 270 bottom
U$21  WQP-PJ301M-12_JACK  [WQP-PJ301M-12_JACK]  70.8,103.7 90 bottom
U$22  WQP-PJ301M-12_JACK  [WQP-PJ301M-12_JACK]  115.1,103.8 90 bottom
U$23  WQP-PJ301M-12_JACK  [WQP-PJ301M-12_JACK]  206,7 270 bottom
U$25  WQP-PJ301M-12_JACK  [WQP-PJ301M-12_JACK]  84.5,-7.7 90 bottom  (outside the outline)
U$26  WQP-PJ301M-12_JACK  [WQP-PJ301M-12_JACK]  118.7,-7.5 90 bottom  (outside the outline)
U$27  WQP-PJ301M-12_JACK  [WQP-PJ301M-12_JACK]  128.8,28.2 180 bottom
U$28  WQP-PJ301M-12_JACK  [WQP-PJ301M-12_JACK]  158.4,34.4 270 bottom
U$29  WQP-PJ301M-12_JACK  [WQP-PJ301M-12_JACK]  192.1,102.3 180 bottom
U$30  WQP-PJ301M-12_JACK  [WQP-PJ301M-12_JACK]  206.8,102.5 180 bottom
U$31  WQP-PJ301M-12_JACK  [WQP-PJ301M-12_JACK]  137.5,103.9 90 bottom
VR1  100k  [POT-PTH-ALPS-KIT]  190.04,36.98 180 bottom
VR2  100k  [POT-PTH-ALPS-KIT]  190.14,21.96 180 bottom
VR3  10k  [POT-PTH-ALPS-KIT]  190.04,52 180 bottom
VR4  10k  [POT-PTH-ALPS-KIT]  190.04,7.04 180 bottom
VR5  100k  [POT-PTH-ALPS-KIT]  99.06,-7.72 0 bottom  (outside the outline)
VR6  10k  [POT-PTH-ALPS-KIT]  142.36,-7.5 0 bottom  (outside the outline)
VR7  100k  [POT-PTH-ALPS-KIT]  128.72,13.64 90 bottom
VR8  10k  [POT-PTH-ALPS-KIT]  143.74,34.46 180 bottom
X1  2510-  [PAK100/2500-10]  256.7,36.67 90 bottom  (outside the outline)
Y1  12.288MHz  [CRYSTAL-SMD-5X3.2-4PAD]  86.73,41.68 270 bottom